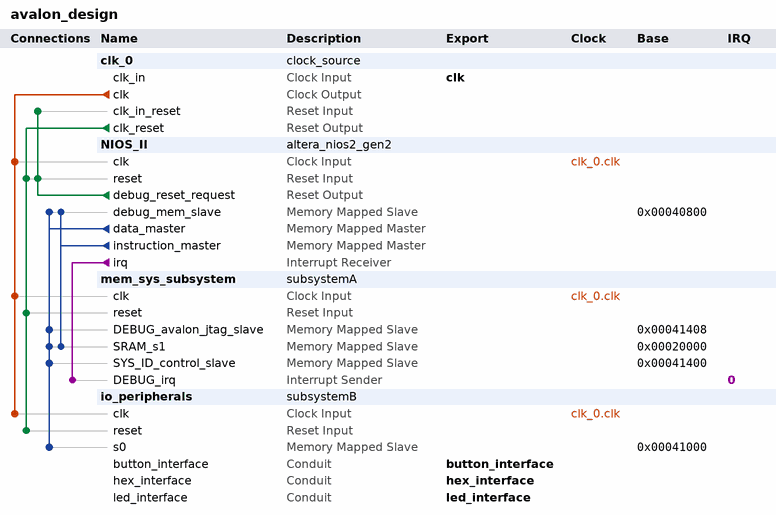
[diagram p0: system contents]
# Platform Designer (Qsys) system avalon_design, MAX 10 10M50DAF484C7G
# Parameters at their usual value, and those the tool derives, are not listed.
package require -exact qsys 18.1
create_system avalon_design
set_project_property DEVICE_FAMILY {MAX 10}
set_project_property DEVICE 10M50DAF484C7G

add_instance clk_0 clock_source 18.1
set_instance_parameter_value clk_0 clockFrequency 50000000

add_instance NIOS_II altera_nios2_gen2 18.1
set_instance_parameter_value NIOS_II dcache_size 2048
set_instance_parameter_value NIOS_II exceptionSlave mem_sys_subsystem_SRAM.s1
set_instance_parameter_value NIOS_II icache_size 4096
set_instance_parameter_value NIOS_II impl Fast
set_instance_parameter_value NIOS_II resetSlave mem_sys_subsystem_SRAM.s1

add_instance mem_sys_subsystem subsystemA 1.0

add_instance io_peripherals subsystemB 1.0

# connections
add_connection clk_0.clk io_peripherals.clk clock
add_connection clk_0.clk mem_sys_subsystem.clk clock
add_connection clk_0.clk NIOS_II.clk clock
add_connection clk_0.clk_reset io_peripherals.reset reset
add_connection clk_0.clk_reset mem_sys_subsystem.reset reset
add_connection clk_0.clk_reset NIOS_II.reset reset
add_connection NIOS_II.debug_reset_request clk_0.clk_in_reset reset
add_connection NIOS_II.debug_reset_request NIOS_II.reset reset
add_connection NIOS_II.data_master io_peripherals.s0 avalon
set_connection_parameter_value NIOS_II.data_master/io_peripherals.s0 baseAddress 0x00041000
add_connection NIOS_II.data_master mem_sys_subsystem.DEBUG_avalon_jtag_slave avalon
set_connection_parameter_value NIOS_II.data_master/mem_sys_subsystem.DEBUG_avalon_jtag_slave baseAddress 0x00041408
add_connection NIOS_II.data_master mem_sys_subsystem.SRAM_s1 avalon
set_connection_parameter_value NIOS_II.data_master/mem_sys_subsystem.SRAM_s1 baseAddress 0x00020000
add_connection NIOS_II.data_master mem_sys_subsystem.SYS_ID_control_slave avalon
set_connection_parameter_value NIOS_II.data_master/mem_sys_subsystem.SYS_ID_control_slave baseAddress 0x00041400
add_connection NIOS_II.data_master NIOS_II.debug_mem_slave avalon
set_connection_parameter_value NIOS_II.data_master/NIOS_II.debug_mem_slave baseAddress 0x00040800
add_connection NIOS_II.instruction_master mem_sys_subsystem.SRAM_s1 avalon
set_connection_parameter_value NIOS_II.instruction_master/mem_sys_subsystem.SRAM_s1 baseAddress 0x00020000
add_connection NIOS_II.instruction_master NIOS_II.debug_mem_slave avalon
set_connection_parameter_value NIOS_II.instruction_master/NIOS_II.debug_mem_slave baseAddress 0x00040800
add_connection NIOS_II.irq mem_sys_subsystem.DEBUG_irq interrupt
set_connection_parameter_value NIOS_II.irq/mem_sys_subsystem.DEBUG_irq irqNumber 0

# exported interfaces
add_interface button_interface conduit end
set_interface_property button_interface EXPORT_OF io_peripherals.button_interface
add_interface clk clock sink
set_interface_property clk EXPORT_OF clk_0.clk_in
add_interface hex_interface conduit end
set_interface_property hex_interface EXPORT_OF io_peripherals.hex_interface
add_interface led_interface conduit end
set_interface_property led_interface EXPORT_OF io_peripherals.led_interface

set_interconnect_requirement {$system} qsys_mm.clockCrossingAdapter HANDSHAKE
set_interconnect_requirement {$system} qsys_mm.enableEccProtection FALSE
set_interconnect_requirement {$system} qsys_mm.insertDefaultSlave FALSE
set_interconnect_requirement {$system} qsys_mm.maxAdditionalLatency 1

save_system avalon_design.qsys
